# Altium schematic sheet POWER & BIAS.SchDoc
size B; Organization: Altium Limited; Address1: L3, 12a Rodborough Rd; Address2: Frenchs Forest; Address3: NSW; Address4: Australia 2086
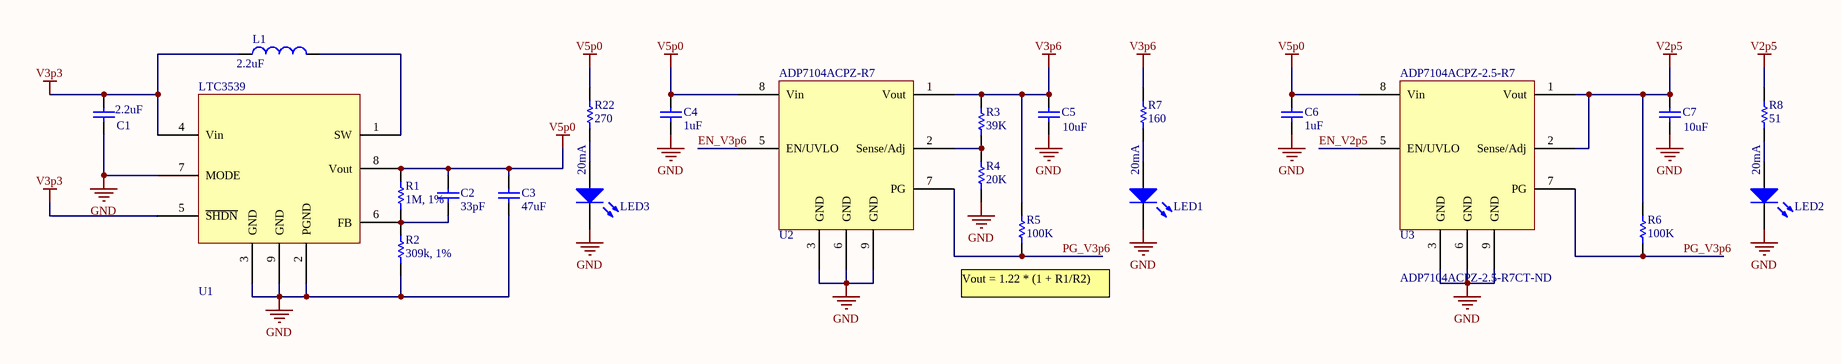
[diagram p0: POWER & BIAS.SchDoc]

## Parts
C1  value 2.2uF  [CAPC1206(3216)170_N]  (hidden comment: 587-1329-2-ND)
C2  value 33pF  [CAPC01005(0402)22_N]  (hidden comment: CAP, 0402, 33pF)
C3  value 47uF  [CAPC1206(3216)170_N]  (hidden comment: CAP, 1206, 47uF)
C4  value 1uF  [CAPC01005(0402)22_N]  (hidden comment: CAP, 0402, 1uF)
C5  value 10uF  [CAPC0805(2012)130_N]  (hidden comment: CAP, 0805, 10uF)
C6  value 1uF  [CAPC01005(0402)22_N]  (hidden comment: CAP, 0402, 1uF)
C7  value 10uF  [CAPC0805(2012)130_N]  (hidden comment: CAP, 0805, 10uF)
L1  value 2.2uF  [INDUCTOR, SMD, TDK]  (hidden comment: INDUCTOR, SMD, 2.2uF)
LED1  LED, GREEN, 0603, LITE-ON  [0603, LED]  (value not drawn)
LED2  LED, GREEN, 0603, LITE-ON  [0603, LED]  (value not drawn)
LED3  LED, GREEN, 0603, LITE-ON  [0603, LED]  (value not drawn)
R1  value 1M, 1%  [RESC0402(1005)_N]  (hidden comment: RES, 0402, 1M, 1%)
R2  value 309k, 1%  [RESC0402(1005)_N]  (hidden comment: RES, 0402, 309k, 1%)
R3  39K  [RES, 0603]
R4  20K  [RES, 0603]
R5  100K  [RES, 0603]
R6  100K  [RES, 0603]
R7  160  [RESC1005X04N]
R8  51  [RESC1005X04N]
R22  270  [RES, 0603]
U1  LTC3539  [QFN45P300X200X80-8N]
U2  ADP7104ACPZ-R7  [QFN50P300X300X75-8N]
U3  ADP7104ACPZ-2.5-R7  Supplier Part Number 1: ADP7104ACPZ-2.5-R7CT-ND  [QFN50P300X300X75-8N]

## Nets
GND: C1.1 C3.1 C4.1 C5.1 C6.1 C7.1 LED1.1(C) LED2.1(C) LED3.1(C) R2.1 R4.1 U1.2(PGND) U1.3(GND) U1.7(MODE) U1.9(GND) U2.3(GND) U2.6(GND) U2.9(GND) U3.3(GND) U3.6(GND) U3.9(GND)
V2p5: C7.2 R6.2 R8.2 U3.1(Vout) U3.2(Sense/Adj)
V3p3: C1.2 L1.1 U1.4(Vin) U1.5(~{SHDN})
V3p6: C5.2 R3.2 R5.2 R7.2 U2.1(Vout)
V5p0: C2.2 C3.2 C4.2 C6.2 R1.2 R22.2 U1.8(Vout) U2.8(Vin) U3.8(Vin)
EN_V2p5: U3.5(EN/UVLO)
EN_V3p6: U2.5(EN/UVLO)
PG_V3p6: R5.1 R6.1 U2.7(PG) U3.7(PG)
NetC2_1: C2.1 R1.1 R2.2 U1.6(FB)
NetL1_2: L1.2 U1.1(SW)
NetLED1_2: LED1.2(A) R7.1
NetLED2_2: LED2.2(A) R8.1
NetLED3_2: LED3.2(A) R22.1
NetR3_1: R3.1 R4.2 U2.2(Sense/Adj)

## Notes on the sheet
- 20mA
- (near R5) Vout = 1.22 * (1 + R1/R2)
- Title
- Size:
- Date:
- B
- Number:
- Time:
- Revision:
- Sheet
- of
- File:

## Library data of the parts
C1 = CAP, 1206, 2.2uF: Supplier 1: Digi-Key; Supplier Part Number 1: 587-1329-1-ND
R3 = RES_0603_39K: Resistor, 0603, 1/10W, 39K ohm; Manufacturer: Panasonic Electronic Components; Manufacturer Part Number: ERJ-3EKF3902V; Description: RES 39K OHM 1/10W 1% 0603 SMD; Tolerance: ±1%; Power (Watts): 0.1W, 1/10W; Temperature Coefficient: ±100ppm/°C; Supplier 1: Digi-Key; RoHS: RoHS Compliant; Category: Resistors; Stock 1: 188167; Pricing 1: 1=0.1, 50=0.0138, 100=0.0105, 250=0.0078, 500=0.00576, 1000=0.00384 (USD); Packaging: Cut Tape (CT); Resistance (Ohms): 39k; Composition: Thick Film; Features: -; Package / Case: 0603 (1608 Metric); Supplier Device Package: 0603; Size / Dimension: 0.063" L x 0.031" W (1.60mm x 0.80mm); Height: 0.022" (0.55mm); Number of Terminations: 2; ComponentLink1URL: http://industrial.panasonic.com/www-cgi/jvcr13pz.cgi?E+PZ+3+AOA0002+ERJ3EKF3902V+7+WW; ComponentLink1Description: http://industrial.panasonic.com/www-cgi/jvcr13pz.cgi?E+PZ+3+AOA0002+ERJ3EKF3902V+7+WW; Supplier Part Number 1: P39.0KHCT-ND
R4 = RES_0603_20K: Resistor, 0603, 1/10W, 20K ohm; Manufacturer: Panasonic Electronic Components; Manufacturer Part Number: ERJ-3EKF2002V; Description: RES 20K OHM 1/10W 1% 0603 SMD; Tolerance: ±1%; Power (Watts): 0.1W, 1/10W; Temperature Coefficient: ±100ppm/°C; Supplier 1: Digi-Key; RoHS: RoHS Compliant; Category: Resistors; Stock 1: 1265750; Pricing 1: 1=0.1, 50=0.0138, 100=0.0105, 250=0.0078, 500=0.00576, 1000=0.00384 (USD); Packaging: Cut Tape (CT); Resistance (Ohms): 20k; Composition: Thick Film; Features: -; Package / Case: 0603 (1608 Metric); Supplier Device Package: 0603; Size / Dimension: 0.063" L x 0.031" W (1.60mm x 0.80mm); Height: 0.022" (0.55mm); Number of Terminations: 2; ComponentLink1URL: http://industrial.panasonic.com/www-cgi/jvcr13pz.cgi?E+PZ+3+AOA0002+ERJ3EKF2002V+7+WW; ComponentLink1Description: http://industrial.panasonic.com/www-cgi/jvcr13pz.cgi?E+PZ+3+AOA0002+ERJ3EKF2002V+7+WW; Supplier Part Number 1: P20.0KHCT-ND
R5 R6 = RES_0603_100K: Resistor, 0603, 1/10W, 100K ohm; Manufacturer: Panasonic Electronic Components; Manufacturer Part Number: ERJ-3EKF1003V; Description: RES 100K OHM 1/10W 1% 0603 SMD; Tolerance: ±1%; Power (Watts): 0.1W, 1/10W; Temperature Coefficient: ±100ppm/°C; Supplier 1: Digi-Key; RoHS: RoHS Compliant; Category: Resistors; Stock 1: 6711812; Pricing 1: 1=0.1, 50=0.0138, 100=0.0105, 250=0.0078, 500=0.00576, 1000=0.00384 (USD); Packaging: Cut Tape (CT); Resistance (Ohms): 100k; Composition: Thick Film; Features: -; Package / Case: 0603 (1608 Metric); Supplier Device Package: 0603; Size / Dimension: 0.063" L x 0.031" W (1.60mm x 0.80mm); Height: 0.022" (0.55mm); Number of Terminations: 2; ComponentLink1URL: http://industrial.panasonic.com/www-cgi/jvcr13pz.cgi?E+PZ+3+AOA0002+ERJ3EKF1003V+7+WW; ComponentLink1Description: http://industrial.panasonic.com/www-cgi/jvcr13pz.cgi?E+PZ+3+AOA0002+ERJ3EKF1003V+7+WW; Supplier Part Number 1: P100KHCT-ND
R7 = RES_0402_160: Resistor, 0402, 1/10W, 160 ohm; Manufacturer: Panasonic Electronic Components; Manufacturer Part Number: ERJ-2RKF1600X; Description: RES 160 OHM 1/10W 1% 0402 SMD; Tolerance: ±1%; Power (Watts): 0.1W, 1/10W; Temperature Coefficient: ±100ppm/°C; Supplier 1: Digi-Key; RoHS: RoHS Compliant; Category: Resistors; Stock 1: 24822; Pricing 1: 1=0.1, 50=0.0242, 100=0.0184, 250=0.01364, 500=0.01008, 1000=0.00672, 5000=0.00473 (USD); Packaging: Cut Tape (CT); Resistance (Ohms): 160; Composition: Thick Film; Features: -; Package / Case: 0402 (1005 Metric); Supplier Device Package: 0402; Size / Dimension: 0.039" L x 0.020" W (1.00mm x 0.50mm); Height: 0.016" (0.40mm); Number of Terminations: 2; ComponentLink1URL: http://industrial.panasonic.com/www-cgi/jvcr13pz.cgi?E+PZ+3+AOA0002+ERJ2RKF1600X+7+WW; ComponentLink1Description: http://industrial.panasonic.com/www-cgi/jvcr13pz.cgi?E+PZ+3+AOA0002+ERJ2RKF1600X+7+WW; Supplier Part Number 1: P160LCT-ND
R8 = RES_0402_51: Resistor, 0402, 1/10W, 51 ohm; Manufacturer: Panasonic Electronic Components; Manufacturer Part Number: ERJ-2RKF51R0X; Description: RES 51 OHM 1/10W 1% 0402 SMD; Tolerance: ±1%; Power (Watts): 0.1W, 1/10W; Temperature Coefficient: ±100ppm/°C; Supplier 1: Digi-Key; RoHS: RoHS Compliant; Category: Resistors; Stock 1: 127224; Pricing 1: 1=0.1, 50=0.0242, 100=0.0184, 250=0.01364, 500=0.01008, 1000=0.00672, 5000=0.00473 (USD); Packaging: Cut Tape (CT); Resistance (Ohms): 51; Composition: Thick Film; Features: -; Package / Case: 0402 (1005 Metric); Supplier Device Package: 0402; Size / Dimension: 0.039" L x 0.020" W (1.00mm x 0.50mm); Height: 0.016" (0.40mm); Number of Terminations: 2; ComponentLink1URL: http://industrial.panasonic.com/www-cgi/jvcr13pz.cgi?E+PZ+3+AOA0002+ERJ2RKF51R0X+7+WW; ComponentLink1Description: http://industrial.panasonic.com/www-cgi/jvcr13pz.cgi?E+PZ+3+AOA0002+ERJ2RKF51R0X+7+WW; Supplier Part Number 1: P51.0LCT-ND
R22 = RES_0603_270: Resistor, 0603, 1/10W, 270 ohm; Manufacturer: Panasonic Electronic Components; Manufacturer Part Number: ERJ-3EKF2700V; Description: RES 270 OHM 1/10W 1% 0603 SMD; Tolerance: ±1%; Power (Watts): 0.1W, 1/10W; Temperature Coefficient: ±100ppm/°C; Supplier 1: Digi-Key; RoHS: RoHS Compliant; Category: Resistors; Stock 1: 54092; Pricing 1: 1=0.1, 50=0.0138, 100=0.0105, 250=0.0078, 500=0.00576, 1000=0.00384 (USD); Packaging: Cut Tape (CT); Resistance (Ohms): 270; Composition: Thick Film; Features: -; Package / Case: 0603 (1608 Metric); Supplier Device Package: 0603; Size / Dimension: 0.063" L x 0.031" W (1.60mm x 0.80mm); Height: 0.022" (0.55mm); Number of Terminations: 2; ComponentLink1URL: http://industrial.panasonic.com/www-cgi/jvcr13pz.cgi?E+PZ+3+AOA0002+ERJ3EKF2700V+7+WW; ComponentLink1Description: http://industrial.panasonic.com/www-cgi/jvcr13pz.cgi?E+PZ+3+AOA0002+ERJ3EKF2700V+7+WW; Supplier Part Number 1: P270HCT-ND
U1 = LTC3539: 2A, 1MHz/2MHz Synchronous Step-Up DC/DC Converters; Supplier 1: Digi-Key; Supplier Part Number 1: LTC3539EDCB#TRMPBFTR-ND
U2 = ADP7104ACPZ-R7: Adjustable Voltage Regulator; Supplier 1: Digi-Key; Supplier Part Number 1: ADP7104ACPZ-R7CT-ND
U3 = ADP7104ACPZ-2.5-R7: 2.5V Voltage Regulator; Supplier 1: Digi-Key
C2 = CAP, 0402, 33pF: Supplier 1: Digi-Key; Supplier Part Number 1: 587-1205-1-ND
C3 = CAP, 1206, 47uF: Supplier 1: Digi-Key; Supplier Part Number 1: 445-8047-1-ND
C4 C6 = CAP, 0402, 1uF: Supplier 1: Digi-Key; Supplier Part Number 1: 587-3245-1-ND
C5 C7 = CAP, 0805, 10uF: Supplier 1: Digi-Key; Supplier Part Number 1: 587-2985-1-ND
L1 = INDUCTOR, SMD, 2.2uF: Supplier 1: Digi-Key; Supplier Part Number 1: 445-4242-1-ND
LED1-LED3 = LED, GREEN, 0603, LITE-ON: Supplier 1: Digi-Key; Supplier Part Number 1: 160-1446-1-ND
R1 = RES, 0402, 1M, 1%: Supplier 1: Digi-Key; Supplier Part Number 1: P1.00MLCT-ND
R2 = RES, 0402, 309k, 1%: Supplier 1: Digi-Key; Supplier Part Number 1: RHM309KBHCT-ND